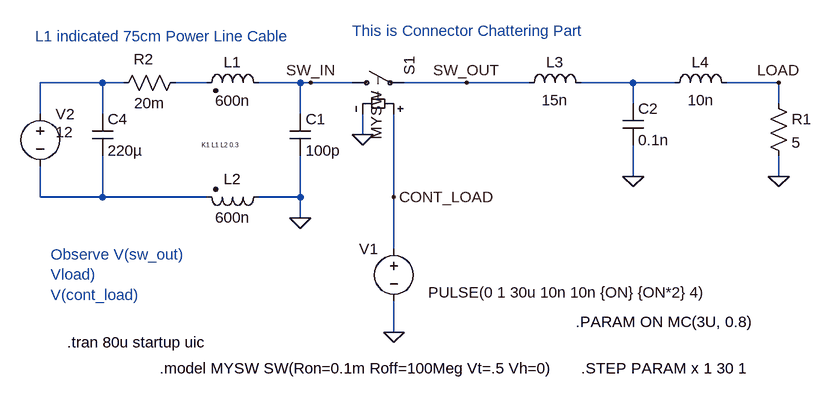
[diagram p0: schematic Fig_11-13_Test_Chattering_MC.asc]
Fig_11-13_Test_Chattering_MC.asc, the LTspice schematic file:
Version 4
SHEET 1 1524 680
WIRE 64 128 -32 128
WIRE 96 128 64 128
WIRE 224 128 176 128
WIRE 368 128 304 128
WIRE 384 128 368 128
WIRE 448 128 384 128
WIRE 624 128 528 128
WIRE 720 128 624 128
WIRE 880 128 800 128
WIRE 944 128 880 128
WIRE 1104 128 1024 128
WIRE 880 160 880 128
WIRE 1104 160 1104 128
WIRE -32 176 -32 128
WIRE 64 176 64 128
WIRE 368 176 368 128
WIRE 464 208 464 176
WIRE 880 272 880 224
WIRE 1104 272 1104 240
WIRE -32 304 -32 256
WIRE 64 304 64 240
WIRE 64 304 -32 304
WIRE 224 304 64 304
WIRE 368 304 368 240
WIRE 368 304 304 304
WIRE 512 304 512 176
WIRE 368 336 368 304
WIRE 512 384 512 304
WIRE 512 512 512 464
FLAG 464 208 0
FLAG 512 512 0
FLAG 1104 272 0
FLAG 512 304 CONT_LOAD
FLAG 1104 128 LOAD
FLAG 368 336 0
FLAG 384 128 SW_IN
FLAG 624 128 SW_OUT
FLAG 880 272 0
SYMBOL sw 432 128 R270
WINDOW 0 12 104 Left 2
WINDOW 3 -88 53 Left 2
SYMATTR InstName S1
SYMATTR Value MYSW
SYMBOL voltage 512 368 M0
WINDOW 3 -484 83 Left 2
WINDOW 123 0 0 Left 2
WINDOW 39 0 0 Left 2
SYMATTR Value PULSE(0 1 30u 10n 10n {ON} {ON*2} 4)
SYMATTR InstName V1
SYMBOL res 1088 144 R0
SYMATTR InstName R1
SYMATTR Value 5
SYMBOL voltage -32 160 R0
WINDOW 123 0 0 Left 2
WINDOW 39 0 0 Left 2
WINDOW 3 24 44 Left 2
SYMATTR Value 12
SYMATTR InstName V2
SYMBOL cap 352 176 R0
SYMATTR InstName C1
SYMATTR Value 100p
SYMBOL ind2 320 144 M270
WINDOW 0 32 56 VTop 2
WINDOW 3 4 56 VBottom 2
SYMATTR InstName L1
SYMATTR Value 600n
SYMBOL ind2 320 288 R90
WINDOW 0 4 56 VBottom 2
WINDOW 3 32 56 VTop 2
SYMATTR InstName L2
SYMATTR Value 600n
SYMBOL res 192 112 R90
WINDOW 0 -5 65 VBottom 2
WINDOW 3 32 56 VTop 2
SYMATTR InstName R2
SYMATTR Value 20m
SYMBOL ind 704 144 R270
WINDOW 0 32 56 VTop 2
WINDOW 3 5 56 VBottom 2
SYMATTR InstName L3
SYMATTR Value 15n
SYMBOL cap 48 176 R0
SYMATTR InstName C4
SYMATTR Value 220µ
SYMBOL cap 864 160 R0
SYMATTR InstName C2
SYMATTR Value 0.1n
SYMBOL ind 928 144 R270
WINDOW 0 32 56 VTop 2
WINDOW 3 5 56 VBottom 2
SYMATTR InstName L4
SYMATTR Value 10n
TEXT 760 568 Right 2 !.model MYSW SW(Ron=0.1m Roff=100Meg Vt=.5 Vh=0)
TEXT 224 528 Right 2 !.tran 80u startup uic
TEXT 216 224 Left 0 !K1 L1 L2 0.3
TEXT -16 392 Left 2 ;Observe V(sw_out)\nVload)\nV(cont_load)
TEXT 448 48 Left 2 ;This is Connector Chattering Part
TEXT -40 56 Left 2 ;L1 indicated 75cm Power Line Cable
TEXT 800 568 Left 2 !.STEP PARAM x 1 30 1
TEXT 792 496 Left 2 !.PARAM ON MC(3U, 0.8)

The netlist it stands for:
* Fig_11-13_Test_Chattering_MC.asc
S1 SW_IN SW_OUT CONT_LOAD 0 MYSW
V1 CONT_LOAD 0 PULSE(0 1 30u 10n 10n {ON} {ON*2} 4)
R1 LOAD 0 5
V2 N001 N004 12
C1 SW_IN 0 100p
L1 SW_IN N002 600n
L2 0 N004 600n
R2 N002 N001 20m
L3 SW_OUT N003 15n
C4 N001 N004 220µ
C2 N003 0 0.1n
L4 N003 LOAD 10n
.model MYSW SW(Ron=0.1m Roff=100Meg Vt=.5 Vh=0)
.tran 80u startup uic
K1 L1 L2 0.3
* Observe V(sw_out)
* Vload)
* V(cont_load)
* This is Connector Chattering Part
* L1 indicated 75cm Power Line Cable
.STEP PARAM x 1 30 1
.PARAM ON MC(3U, 0.8)
.backanno
.end